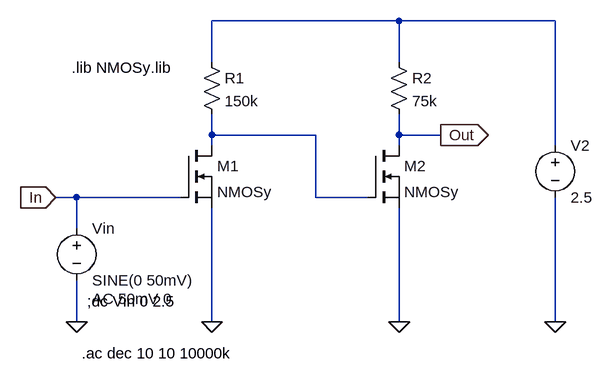
[diagram p0: schematic Draft5.asc]
Draft5.asc, the LTspice schematic file:
Version 4
SHEET 1 880 680
WIRE 352 -208 64 -208
WIRE 592 -208 352 -208
WIRE 64 -144 64 -208
WIRE 352 -144 352 -208
WIRE 64 -32 64 -64
WIRE 224 -32 64 -32
WIRE 352 -32 352 -64
WIRE 416 -32 352 -32
WIRE 64 -16 64 -32
WIRE 352 -16 352 -32
WIRE 592 -16 592 -208
WIRE -144 64 -176 64
WIRE 16 64 -144 64
WIRE 224 64 224 -32
WIRE 304 64 224 64
WIRE -144 112 -144 64
WIRE -144 256 -144 192
WIRE 64 256 64 80
WIRE 352 256 352 80
WIRE 592 256 592 64
FLAG 64 256 0
FLAG 352 256 0
FLAG -144 256 0
FLAG 592 256 0
FLAG 416 -32 Out
IOPIN 416 -32 Out
FLAG -176 64 In
IOPIN -176 64 In
SYMBOL nmos 16 -16 R0
SYMATTR InstName M1
SYMATTR Value NMOSy
SYMBOL nmos 304 -16 R0
SYMATTR InstName M2
SYMATTR Value NMOSy
SYMBOL res 48 -160 R0
SYMATTR InstName R1
SYMATTR Value 150k
SYMBOL res 336 -160 R0
SYMATTR InstName R2
SYMATTR Value 75k
SYMBOL voltage -144 96 R0
WINDOW 123 24 124 Left 2
WINDOW 39 0 0 Left 0
SYMATTR InstName Vin
SYMATTR Value SINE(0 50mV)
SYMATTR Value2 AC 50mV 0
SYMBOL voltage 592 -32 R0
SYMATTR InstName V2
SYMATTR Value 2.5
TEXT -152 -136 Left 2 !.lib NMOSy.lib
TEXT -128 224 Left 2 !;dc Vin 0 2.5
TEXT -136 304 Left 2 !.ac dec 10 10 10000k

The netlist it stands for:
* Draft5.asc
M1 N002 In 0 0 NMOSy
M2 Out N002 0 0 NMOSy
R1 N001 N002 150k
R2 N001 Out 75k
Vin In 0 SINE(0 50mV) AC 50mV 0
V2 N001 0 2.5
.model NMOS NMOS
.model PMOS PMOS
.lib standard.mos
.lib NMOSy.lib
;dc Vin 0 2.5
.ac dec 10 10 10000k
.backanno
.end